# Altium schematic sheet Top.SchDoc: Top Connections
size A4; Revision: 2.0; SheetNumber: 1; SheetTotal: 7; DrawnBy: KSN; Engineer: Dim Su; ContentRev1: Original Document; dateREV1: "Aug/08/2018"; NameRev1: V1; NameRev2: V2; dateREV2: "Sep/03/2018"; ContentRev2: Test pin added; Rev1: V1; Rev2: V2; Project: LED_MAT_3
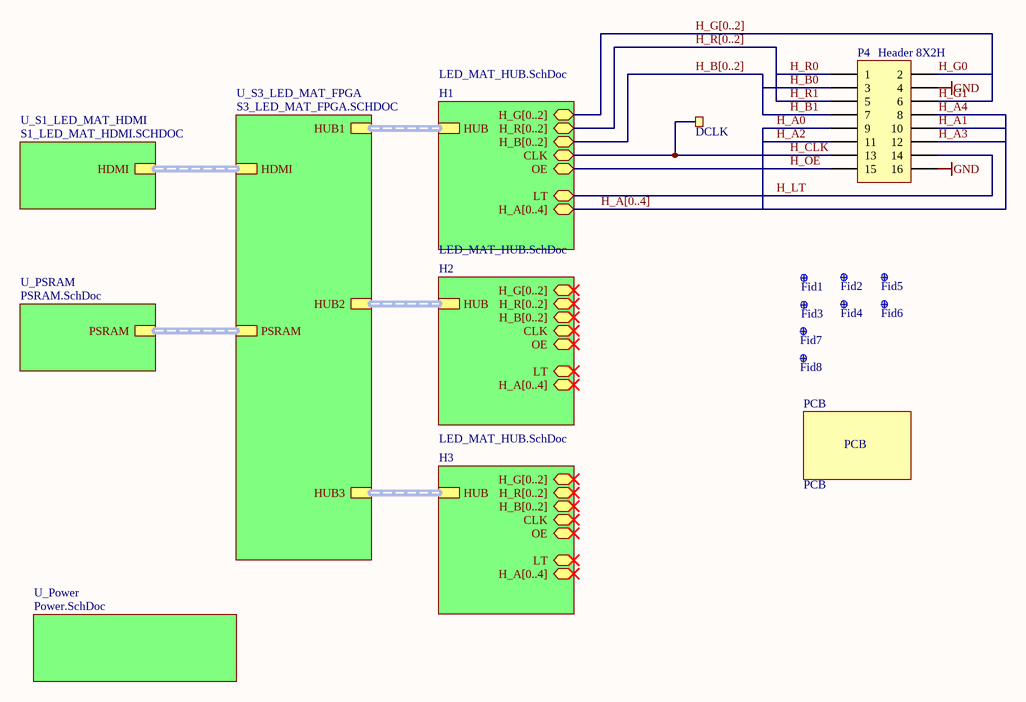
[diagram p0: Top.SchDoc]

## Parts
DCLK  Ø1.0mm,SMD  [TP_SMD_1MM]  (value not drawn)  (no BOM)
Fid1  Fiducial mark  [Pass-marke-02]  (value not drawn)  (no BOM)
Fid2  Fiducial mark  [Pass-marke-02]  (value not drawn)  (no BOM)
Fid3  Fiducial mark  [Pass-marke-02]  (value not drawn)  (no BOM)
Fid4  Fiducial mark  [Pass-marke-02]  (value not drawn)  (no BOM)
Fid5  Fiducial mark  [Pass-marke-02]  (value not drawn)  (no BOM)
Fid6  Fiducial mark  [Pass-marke-02]  (value not drawn)  (no BOM)
Fid7  Fiducial mark  [Pass-marke-02]  (value not drawn)  (no BOM)
Fid8  Fiducial mark  [Pass-marke-02]  (value not drawn)  (no BOM)
P4  Header 8X2H  [HDR2X8H]
PCB  PCB  (mechanical)

## Sub-sheets
H1 = LED_MAT_HUB.SchDoc: HUB (harness HUB), H_B[0..2] (bidir), H_G[0..2] (bidir), H_R[0..2] (bidir), H_A[0..4] (bidir), CLK (bidir), OE (bidir), LT (bidir)
H2 = LED_MAT_HUB.SchDoc: HUB (harness HUB), H_B[0..2] (bidir), H_G[0..2] (bidir), H_R[0..2] (bidir), H_A[0..4] (bidir), CLK (bidir), OE (bidir), LT (bidir)
H3 = LED_MAT_HUB.SchDoc: HUB (harness HUB), H_B[0..2] (bidir), H_G[0..2] (bidir), H_R[0..2] (bidir), H_A[0..4] (bidir), CLK (bidir), OE (bidir), LT (bidir)
U_Power = Power.SchDoc: no entries
U_PSRAM = PSRAM.SchDoc: PSRAM (harness PSRAM)
U_S1_LED_MAT_HDMI = S1_LED_MAT_HDMI.SCHDOC: HDMI (harness HDMI)
U_S3_LED_MAT_FPGA = S3_LED_MAT_FPGA.SCHDOC: HUB2 (harness HUB), HUB1 (harness HUB), HUB3 (harness HUB), HDMI (harness HDMI), PSRAM (harness PSRAM)

## Nets
GND: P4.4 P4.16
H_A0: P4.9
H_A1: P4.10
H_A2: P4.11
H_A3: P4.12
H_A4: P4.8
H_B0: P4.3
H_B1: P4.7
H_CLK: DCLK.1 P4.13 ; sheet H1/CLK
H_G0: P4.2
H_G1: P4.6
H_LT: P4.14 ; sheet H1/LT
H_OE: P4.15 ; sheet H1/OE
H_R0: P4.1
H_R1: P4.5

## Buses and harness runs
bus H_A[0..4] = sheet H1/H_A[0..4]
bus H_B[0..2] = sheet H1/H_B[0..2]
bus H_G[0..2] = sheet H1/H_G[0..2]
bus H_R[0..2] = sheet H1/H_R[0..2]
harness sheet H1/HUB = sheet U_S3_LED_MAT_FPGA/HUB1
harness sheet H2/HUB = sheet U_S3_LED_MAT_FPGA/HUB2
harness sheet H3/HUB = sheet U_S3_LED_MAT_FPGA/HUB3
harness sheet U_PSRAM/PSRAM = sheet U_S3_LED_MAT_FPGA/PSRAM
harness sheet U_S1_LED_MAT_HDMI/HDMI = sheet U_S3_LED_MAT_FPGA/HDMI

## Notes on the sheet
- Title
- Size:
- Date:
- A4
- Number:
- Time:
- Revision:
- Sheet
- of
- File:

## Library data of the parts
DCLK = TESTPAD_SMD: circular SMD testpad 1mm; Manufacturer Part Number: *; Value: Ø1.0mm,SMD; Supplier: *; Category: Pattern
Fid1-Fid8 = Fiducial: Value: FM; Remarks: Pattern; Manufacturer: *; Manufacturer Part Number: *; Supplier: *; Category: Pattern; Price: 0; Temperature: ./.
P4 = Header 8X2H: Header, 8-Pin, Dual row, Right Angle; CompName: Connector; Price: .5
PCB = PCB: PNEC_Bridge_v1 PCB/FR4/1.55mm/8L/ENIG; Manufacturer: ./.; Value: 70x127.5x1.6mm 6 Layers; Category: PCB; Manufacturer Part Number: ./.; Package: 70x127.5x1.6mm 6 Layers; Price: 60; Remarks: ./.; Supplier: ./.; Supplier Order Code: ./.; Temperature: ./.; Tolerance: ./.; Type: 70x127.5x1.6mm 6 Layers; Voltage: ./.